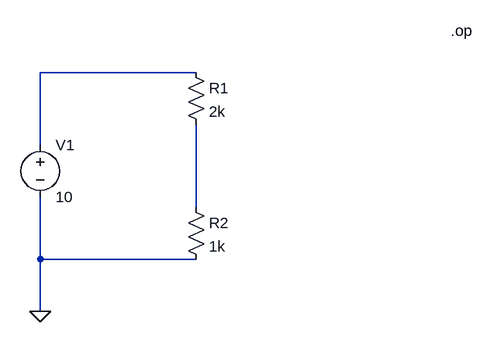
[diagram p0: schematic PreLab 2 pt 1.asc]
PreLab 2 pt 1.asc, the LTspice schematic file:
Version 4
SHEET 1 880 680
WIRE 368 144 128 144
WIRE 128 256 128 144
WIRE 368 352 368 224
WIRE 128 432 128 336
WIRE 368 432 128 432
WIRE 128 512 128 432
FLAG 128 512 0
SYMBOL res 352 128 R0
SYMATTR InstName R1
SYMATTR Value 2k
SYMBOL res 352 336 R0
SYMATTR InstName R2
SYMATTR Value 1k
SYMBOL voltage 128 240 R0
SYMATTR InstName V1
SYMATTR Value 10
TEXT 760 80 Left 2 !.op

The netlist it stands for:
* PreLab 2 pt 1.asc
R1 N001 N002 2k
R2 N002 0 1k
V1 N001 0 10
.op
.backanno
.end